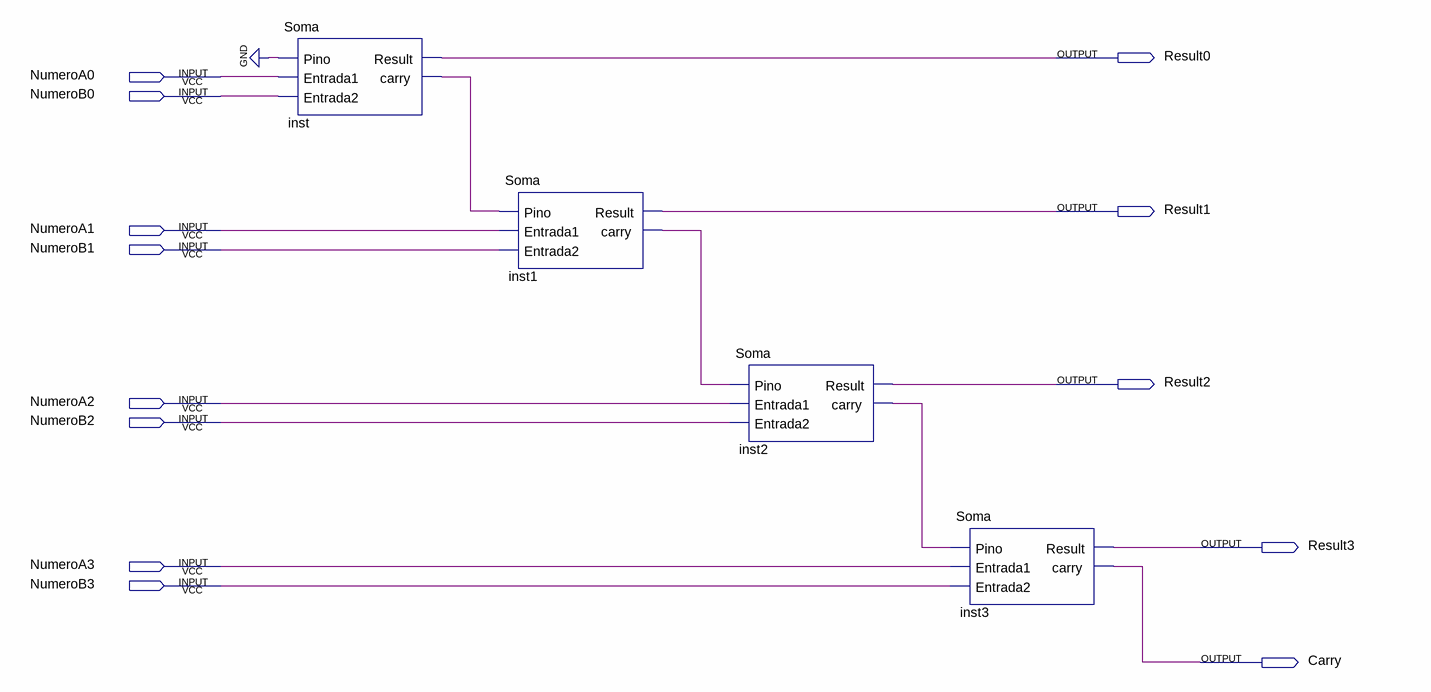
[diagram p0: schematic sheet]
// Quartus schematic Somador4bits.bdf as structural Verilog: 4 symbols, 13 pins
module Somador4bits (
  input  NumeroA0,
  input  NumeroB0,
  input  NumeroA1,
  input  NumeroB1,
  input  NumeroA2,
  input  NumeroB2,
  input  NumeroA3,
  input  NumeroB3,
  output Result0,
  output Result1,
  output Result2,
  output Result3,
  output Carry
);

  wire inst1_carry, inst2_carry, inst_carry;

  Soma inst (.Pino(1'b0), .Entrada1(NumeroA0), .Entrada2(NumeroB0), .Result(Result0), .carry(inst_carry));
  Soma inst1 (.Pino(inst_carry), .Entrada1(NumeroA1), .Entrada2(NumeroB1), .Result(Result1), .carry(inst1_carry));
  Soma inst2 (.Pino(inst1_carry), .Entrada1(NumeroA2), .Entrada2(NumeroB2), .Result(Result2), .carry(inst2_carry));
  Soma inst3 (.Pino(inst2_carry), .Entrada1(NumeroA3), .Entrada2(NumeroB3), .Result(Result3), .carry(Carry));
endmodule
